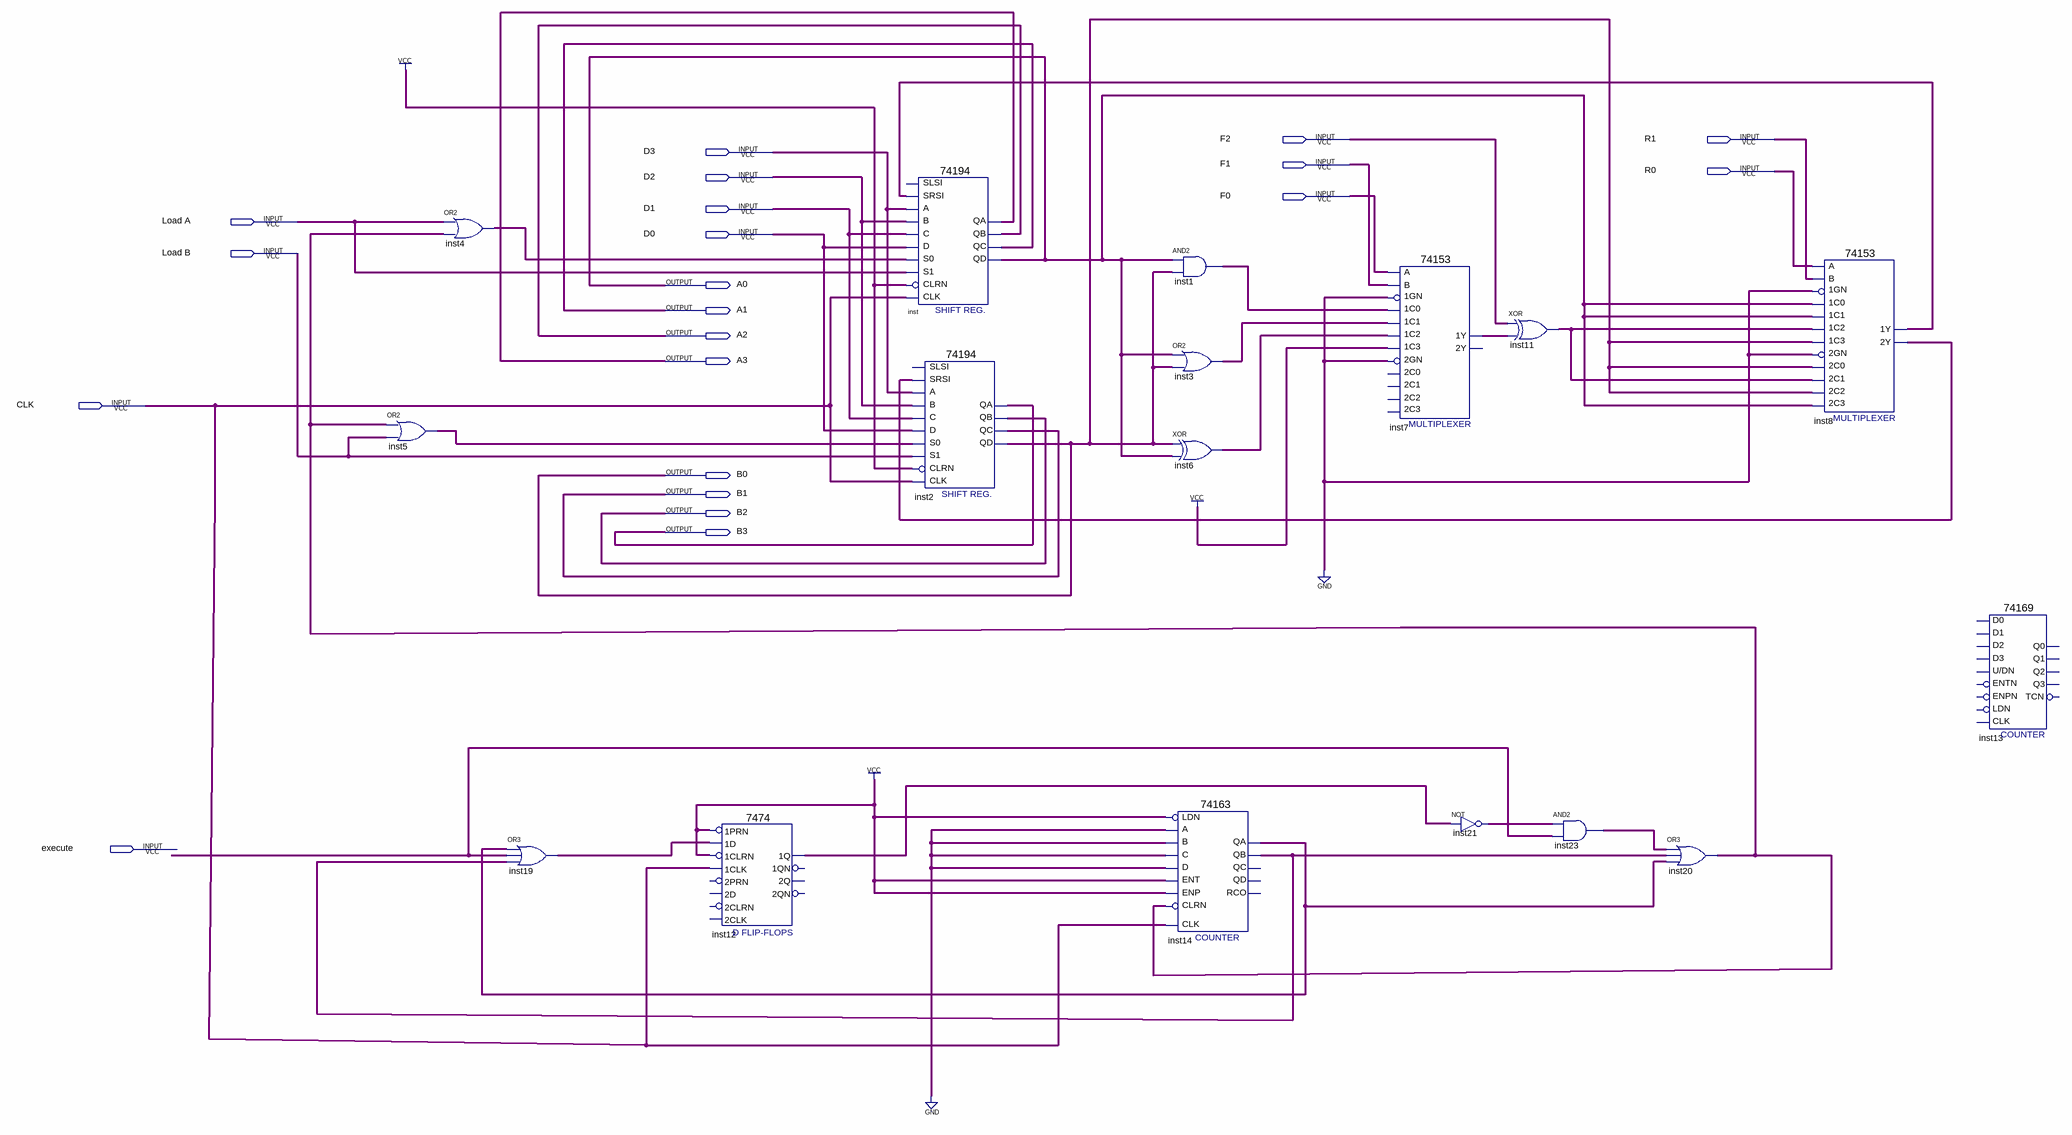
[diagram p0: schematic sheet]
// Quartus schematic lab2.bdf as structural Verilog: 17 symbols, 21 pins
module lab2 (
  input  F2,
  input  R1,
  input  D3,
  input  F1,
  input  R0,
  input  D2,
  input  F0,
  input  D1,
  input  \Load_A ,
  input  D0,
  input  \Load_B ,
  input  CLK,
  input  execute,
  output A0,
  output A1,
  output A2,
  output A3,
  output B0,
  output B1,
  output B2,
  output B3
);

  wire inst1_out, inst3_out, inst4_out, inst5_out, inst6_out, inst7_1y, inst8_1y, inst8_2y, inst11_out,
       inst12_1q, inst14_qa, inst14_qb, inst19_out, inst20_out, inst21_out, inst23_out, undriven;

  or inst5 (inst5_out, inst20_out, \Load_B );
  or inst4 (inst4_out, \Load_A , inst20_out);
  or inst19 (inst19_out, inst14_qa, undriven, inst14_qb);
  \7474  inst12 (
    .\1CLK (CLK), .\1D (inst19_out), .\1PRN (1'b1), .\1CLRN (1'b1), .\1Q (inst12_1q));  // open: 2D, 2PRN, 2CLK, 2CLRN, 1QN, 2Q, 2QN
  \74194  inst (
    .SRSI(inst8_1y), .B(D2), .C(D1), .CLK(CLK), .CLRN(1'b1), .D(D0), .S1(\Load_A ), .S0(inst4_out), .A(D3),
    .QA(A3), .QB(A2), .QC(A1), .QD(A0));  // open: SLSI
  \74194  inst2 (
    .SRSI(inst8_2y), .B(D2), .C(D1), .CLK(CLK), .CLRN(1'b1), .D(D0), .S1(\Load_B ), .S0(inst5_out), .A(D3),
    .QA(B3), .QB(B2), .QC(B1), .QD(B0));  // open: SLSI
  and inst1 (inst1_out, A0, B0);
  or inst3 (inst3_out, A0, B0);
  xor inst6 (inst6_out, B0, A0);
  \74163  inst14 (
    .C(1'b0), .B(1'b0), .A(1'b0), .ENT(1'b1), .D(1'b0), .CLRN(inst20_out), .CLK(CLK), .ENP(1'b1), .LDN(1'b1),
    .QA(inst14_qa), .QB(inst14_qb));  // open: QC, QD, RCO
  \74153  inst7 (
    .\1C1 (inst3_out), .\1GN (1'b0), .\1C0 (inst1_out), .\2GN (1'b0), .\1C2 (inst6_out), .\1C3 (1'b1),
    .B(F1), .A(F0), .\1Y (inst7_1y));  // open: 2C0, 2C2, 2C1, 2C3, 2Y
  not inst21 (inst21_out, inst12_1q);
  xor inst11 (inst11_out, F2, inst7_1y);
  and inst23 (inst23_out, inst21_out, undriven);
  or inst20 (inst20_out, inst23_out, inst14_qb, inst14_qa);
  \74153  inst8 (
    .\1C1 (A0), .\1GN (1'b0), .\1C0 (A0), .\2C0 (B0), .\2GN (1'b0), .\2C2 (B0), .\1C2 (inst11_out),
    .\1C3 (B0), .B(R1), .A(R0), .\2C1 (inst11_out), .\2C3 (A0), .\1Y (inst8_1y), .\2Y (inst8_2y));
  \74169  inst13 ();  // open: D1, D2, D0, ENTN, U/DN, D3, LDN, CLK, ENPN, Q2, Q1, Q0, TCN, Q3
endmodule
